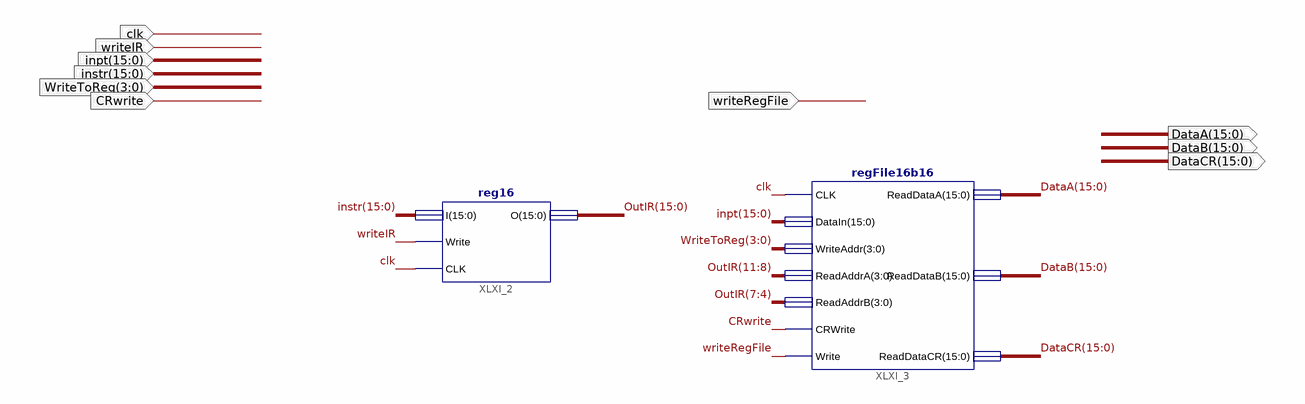
[diagram p0: schematic sheet 1]
// Xilinx ISE schematic IRandRegFile.sch (spartan3e) as structural Verilog: 2 symbols, 10 ports
module IRandRegFile (
  input  writeIR,
  input  clk,
  input  [15:0] instr,
  input  [15:0] inpt,
  input  writeRegFile,
  input  [3:0] WriteToReg,
  input  CRwrite,
  output [15:0] DataA,
  output [15:0] DataB,
  output [15:0] DataCR
);

  wire [15:0] OutIR;

  reg16 XLXI_2 (.I(instr), .Write(writeIR), .CLK(clk), .O(OutIR));
  regFile16b16 XLXI_3 (
    .CLK(clk), .DataIn(inpt), .WriteAddr(WriteToReg), .ReadAddrA(OutIR[11:8]), .ReadAddrB(OutIR[7:4]),
    .CRWrite(CRwrite), .Write(writeRegFile), .ReadDataA(DataA), .ReadDataB(DataB), .ReadDataCR(DataCR));
endmodule
